# Altium schematic sheet connectorA.SchDoc
size A4
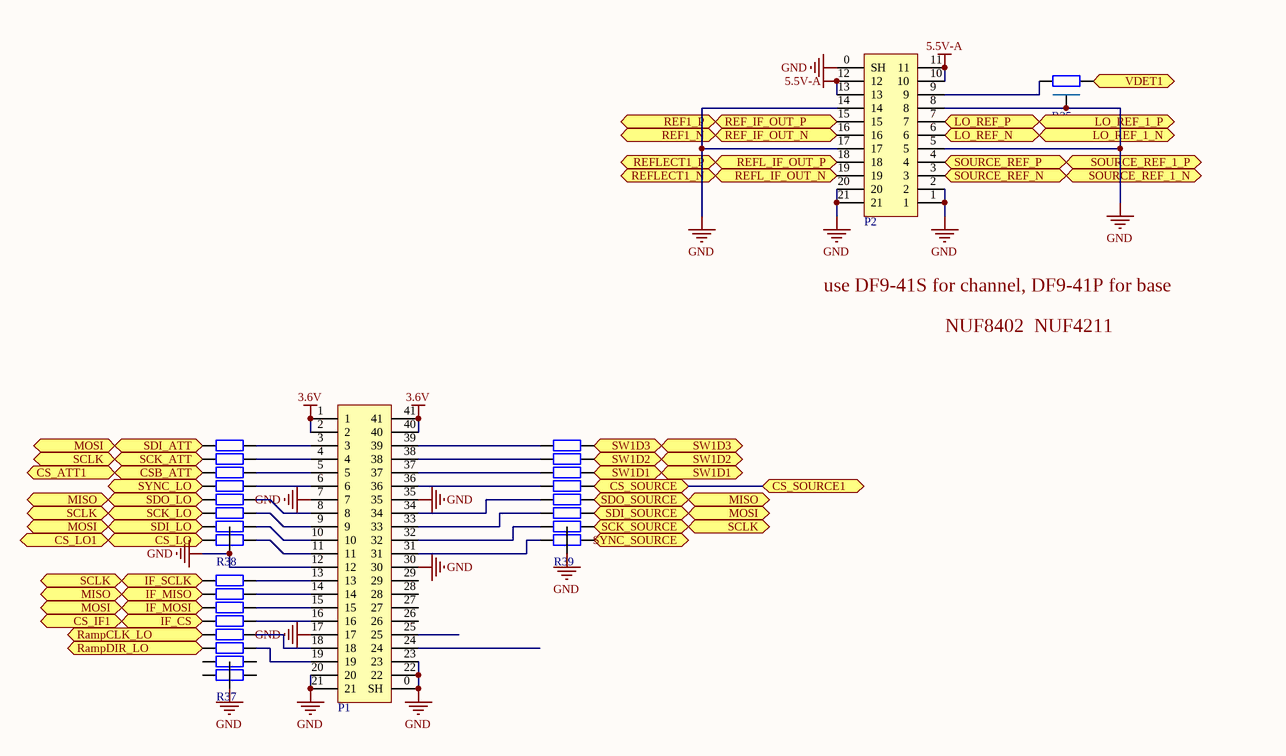
[diagram p0: connectorA.SchDoc]

## Parts
P1  DF9-41S  [VNA_CHANNEL]  (value not drawn)
P2  DF9-21  [DF9-21P]  (value not drawn)
R25  PiFilter  [PiFIiter]  (value not drawn)
R37  NUF8xxx  [NUF8xxx]  (value not drawn)
R38  NUF8xxx  [NUF8xxx]  (value not drawn)
R39  NUF8xxx  [NUF8xxx]  (value not drawn)

## Ports
CS_ATT1, CS_IF1, CS_LO, CS_LO1, CS_SOURCE, CS_SOURCE1, CSB_ATT, IF_CS, IF_MISO, IF_MOSI, IF_SCLK, LO_REF_1_N, LO_REF_1_P, LO_REF_N, LO_REF_P, MISO, MOSI, RampCLK_LO, RampDIR_LO, REF1_N, REF1_P, REF_IF_OUT_N, REF_IF_OUT_P, REFL_IF_OUT_N, REFL_IF_OUT_P, REFLECT1_N, REFLECT1_P, SCK_ATT, SCK_LO, SCK_SOURCE, SCLK, SDI_ATT, SDI_LO, SDI_SOURCE, SDO_LO, SDO_SOURCE, SOURCE_REF_1_N, SOURCE_REF_1_P, SOURCE_REF_N, SOURCE_REF_P, SW1D1, SW1D2, SW1D3, SYNC_LO, SYNC_SOURCE, VDET1

## Nets
3.6V: P1.1 P1.2 P1.40 P1.41
5.5V-A: P2.10 P2.11 P2.12 P2.13
GND: P1.0(SH) P1.7 P1.12 P1.17 P1.20 P1.21 P1.22 P1.23 P1.30 P1.35 P2.0(SH) P2.1 P2.2 P2.5 P2.8 P2.14 P2.17 P2.20 P2.21 R25.3 R37.0 R38.0 R39.0
CS_ATT1: R38.14 ; port CSB_ATT, port CS_ATT1
CS_IF1: R37.13 ; port IF_CS, port CS_IF1
CS_LO: R38.9 ; port CS_LO, port CS_LO1
CS_SOURCE: R39.4 ; port CS_SOURCE, port CS_SOURCE1
IF_MISO: R37.15 R38.12 R39.5 ; port SDO_SOURCE, port SDO_LO, port IF_MISO, port MISO
IF_MOSI: R37.14 R38.10 R38.16 R39.6 ; port SDI_SOURCE, port SDI_ATT, port SDI_LO, port IF_MOSI, port MOSI
IF_SCLK: R37.16 R38.11 R38.15 R39.7 ; port SCK_SOURCE, port SCK_ATT, port SCK_LO, port IF_SCLK, port SCLK
LO_REF_1_N: P2.6 ; port LO_REF_N, port LO_REF_1_N
LO_REF_1_P: P2.7 ; port LO_REF_P, port LO_REF_1_P
RampCLK_LO: R37.12 ; port RampCLK_LO
RampDIR_LO: R37.11 ; port RampDIR_LO
REF1_N: P2.16 ; port REF_IF_OUT_N, port REF1_N
REF1_P: P2.15 ; port REF_IF_OUT_P, port REF1_P
REFL_IF_OUT_N: P2.19 ; port REFL_IF_OUT_N, port REFLECT1_N
REFL_IF_OUT_P: P2.18 ; port REFL_IF_OUT_P, port REFLECT1_P
SOURCE_REF_1_N: P2.3 ; port SOURCE_REF_N, port SOURCE_REF_1_N
SOURCE_REF_1_P: P2.4 ; port SOURCE_REF_P, port SOURCE_REF_1_P
SW1D1: R39.3 ; port SW1D1
SW1D2: R39.2 ; port SW1D2
SW1D3: R39.1 ; port SW1D3
SYNC_LO: R38.13 ; port SYNC_LO
SYNC_SOURCE: R39.8 ; port SYNC_SOURCE
VDET1: R25.1 ; port VDET1
NetP1_3: P1.3 R38.1
NetP1_4: P1.4 R38.2
NetP1_5: P1.5 R38.3
NetP1_6: P1.6 R38.4
NetP1_8: P1.8 R38.5
NetP1_9: P1.9 R38.6
NetP1_10: P1.10 R38.7
NetP1_11: P1.11 R38.8
NetP1_13: P1.13 R37.1
NetP1_14: P1.14 R37.2
NetP1_15: P1.15 R37.3
NetP1_16: P1.16 R37.4
NetP1_18: P1.18 R37.5
NetP1_19: P1.19 R37.6
NetP1_31: P1.31 R39.9
NetP1_32: P1.32 R39.10
NetP1_33: P1.33 R39.11
NetP1_34: P1.34 R39.12
NetP1_36: P1.36 R39.13
NetP1_37: P1.37 R39.14
NetP1_38: P1.38 R39.15
NetP1_39: P1.39 R39.16
NetP2_9: P2.9 R25.2

Not connected (* = marked no-connect by the designer): P1 24 25 26 27 28 29; R37 7 8 9 10

## Notes on the sheet
- use DF9-41S for channel, DF9-41P for base
- NUF8402  NUF4211